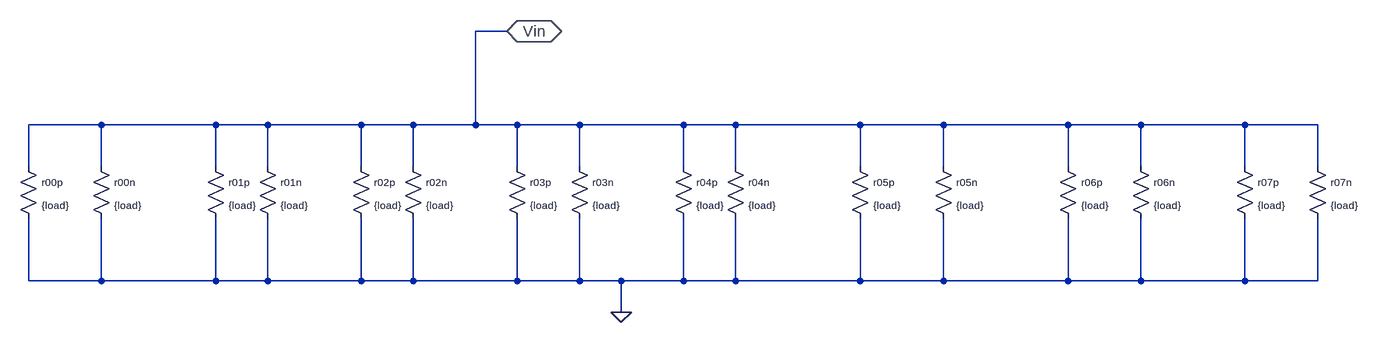
[diagram p0: schematic crossbar.asc]
crossbar.asc, the LTspice schematic file:
Version 4
SHEET 1 2172 680
WIRE 848 -96 800 -96
WIRE 224 48 112 48
WIRE 400 48 224 48
WIRE 480 48 400 48
WIRE 624 48 480 48
WIRE 704 48 624 48
WIRE 800 48 800 -96
WIRE 800 48 704 48
WIRE 864 48 800 48
WIRE 960 48 864 48
WIRE 1120 48 960 48
WIRE 1200 48 1120 48
WIRE 1392 48 1200 48
WIRE 1520 48 1392 48
WIRE 1712 48 1520 48
WIRE 1824 48 1712 48
WIRE 1984 48 1824 48
WIRE 2096 48 1984 48
WIRE 112 112 112 48
WIRE 224 112 224 48
WIRE 400 112 400 48
WIRE 480 112 480 48
WIRE 624 112 624 48
WIRE 704 112 704 48
WIRE 864 112 864 48
WIRE 960 112 960 48
WIRE 1120 112 1120 48
WIRE 1200 112 1200 48
WIRE 1392 112 1392 48
WIRE 1520 112 1520 48
WIRE 1712 112 1712 48
WIRE 1824 112 1824 48
WIRE 1984 112 1984 48
WIRE 2096 112 2096 48
WIRE 112 288 112 192
WIRE 224 288 224 192
WIRE 224 288 112 288
WIRE 400 288 400 192
WIRE 400 288 224 288
WIRE 480 288 480 192
WIRE 480 288 400 288
WIRE 624 288 624 192
WIRE 624 288 480 288
WIRE 704 288 704 192
WIRE 704 288 624 288
WIRE 864 288 864 192
WIRE 864 288 704 288
WIRE 960 288 960 192
WIRE 960 288 864 288
WIRE 1024 288 960 288
WIRE 1120 288 1120 192
WIRE 1120 288 1024 288
WIRE 1200 288 1200 192
WIRE 1200 288 1120 288
WIRE 1392 288 1392 192
WIRE 1392 288 1200 288
WIRE 1520 288 1520 192
WIRE 1520 288 1392 288
WIRE 1712 288 1712 192
WIRE 1712 288 1520 288
WIRE 1824 288 1824 192
WIRE 1824 288 1712 288
WIRE 1984 288 1984 192
WIRE 1984 288 1824 288
WIRE 2096 288 2096 192
WIRE 2096 288 1984 288
WIRE 1024 336 1024 288
FLAG 1024 336 0
FLAG 848 -96 Vin
IOPIN 848 -96 BiDir
SYMBOL res 96 96 R0
WINDOW 0 36 40 Left 1
WINDOW 3 36 76 Left 1
SYMATTR InstName r00p
SYMATTR Value {load}
SYMBOL res 208 96 R0
WINDOW 0 36 40 Left 1
WINDOW 3 36 76 Left 1
SYMATTR InstName r00n
SYMATTR Value {load}
SYMBOL res 384 96 R0
WINDOW 0 36 40 Left 1
WINDOW 3 36 76 Left 1
SYMATTR InstName r01p
SYMATTR Value {load}
SYMBOL res 464 96 R0
WINDOW 0 36 40 Left 1
WINDOW 3 36 76 Left 1
SYMATTR InstName r01n
SYMATTR Value {load}
SYMBOL res 608 96 R0
WINDOW 0 36 40 Left 1
WINDOW 3 36 76 Left 1
SYMATTR InstName r02p
SYMATTR Value {load}
SYMBOL res 688 96 R0
WINDOW 0 36 40 Left 1
WINDOW 3 36 76 Left 1
SYMATTR InstName r02n
SYMATTR Value {load}
SYMBOL res 848 96 R0
WINDOW 0 36 40 Left 1
WINDOW 3 36 76 Left 1
SYMATTR InstName r03p
SYMATTR Value {load}
SYMBOL res 944 96 R0
WINDOW 0 36 40 Left 1
WINDOW 3 36 76 Left 1
SYMATTR InstName r03n
SYMATTR Value {load}
SYMBOL res 1104 96 R0
WINDOW 0 36 40 Left 1
WINDOW 3 36 76 Left 1
SYMATTR InstName r04p
SYMATTR Value {load}
SYMBOL res 1184 96 R0
WINDOW 0 36 40 Left 1
WINDOW 3 36 76 Left 1
SYMATTR InstName r04n
SYMATTR Value {load}
SYMBOL res 1376 96 R0
WINDOW 0 36 40 Left 1
WINDOW 3 36 76 Left 1
SYMATTR InstName r05p
SYMATTR Value {load}
SYMBOL res 1504 96 R0
WINDOW 0 36 40 Left 1
WINDOW 3 36 76 Left 1
SYMATTR InstName r05n
SYMATTR Value {load}
SYMBOL res 1696 96 R0
WINDOW 0 36 40 Left 1
WINDOW 3 36 76 Left 1
SYMATTR InstName r06p
SYMATTR Value {load}
SYMBOL res 1808 96 R0
WINDOW 0 36 40 Left 1
WINDOW 3 36 76 Left 1
SYMATTR InstName r06n
SYMATTR Value {load}
SYMBOL res 1968 96 R0
WINDOW 0 36 40 Left 1
WINDOW 3 36 76 Left 1
SYMATTR InstName r07p
SYMATTR Value {load}
SYMBOL res 2080 96 R0
WINDOW 0 36 40 Left 1
WINDOW 3 36 76 Left 1
SYMATTR InstName r07n
SYMATTR Value {load}

The netlist it stands for:
* crossbar.asc
r00p Vin 0 {load}
r00n Vin 0 {load}
r01p Vin 0 {load}
r01n Vin 0 {load}
r02p Vin 0 {load}
r02n Vin 0 {load}
r03p Vin 0 {load}
r03n Vin 0 {load}
r04p Vin 0 {load}
r04n Vin 0 {load}
r05p Vin 0 {load}
r05n Vin 0 {load}
r06p Vin 0 {load}
r06n Vin 0 {load}
r07p Vin 0 {load}
r07n Vin 0 {load}
.backanno
.end